# Altium project Register.PrjPcb
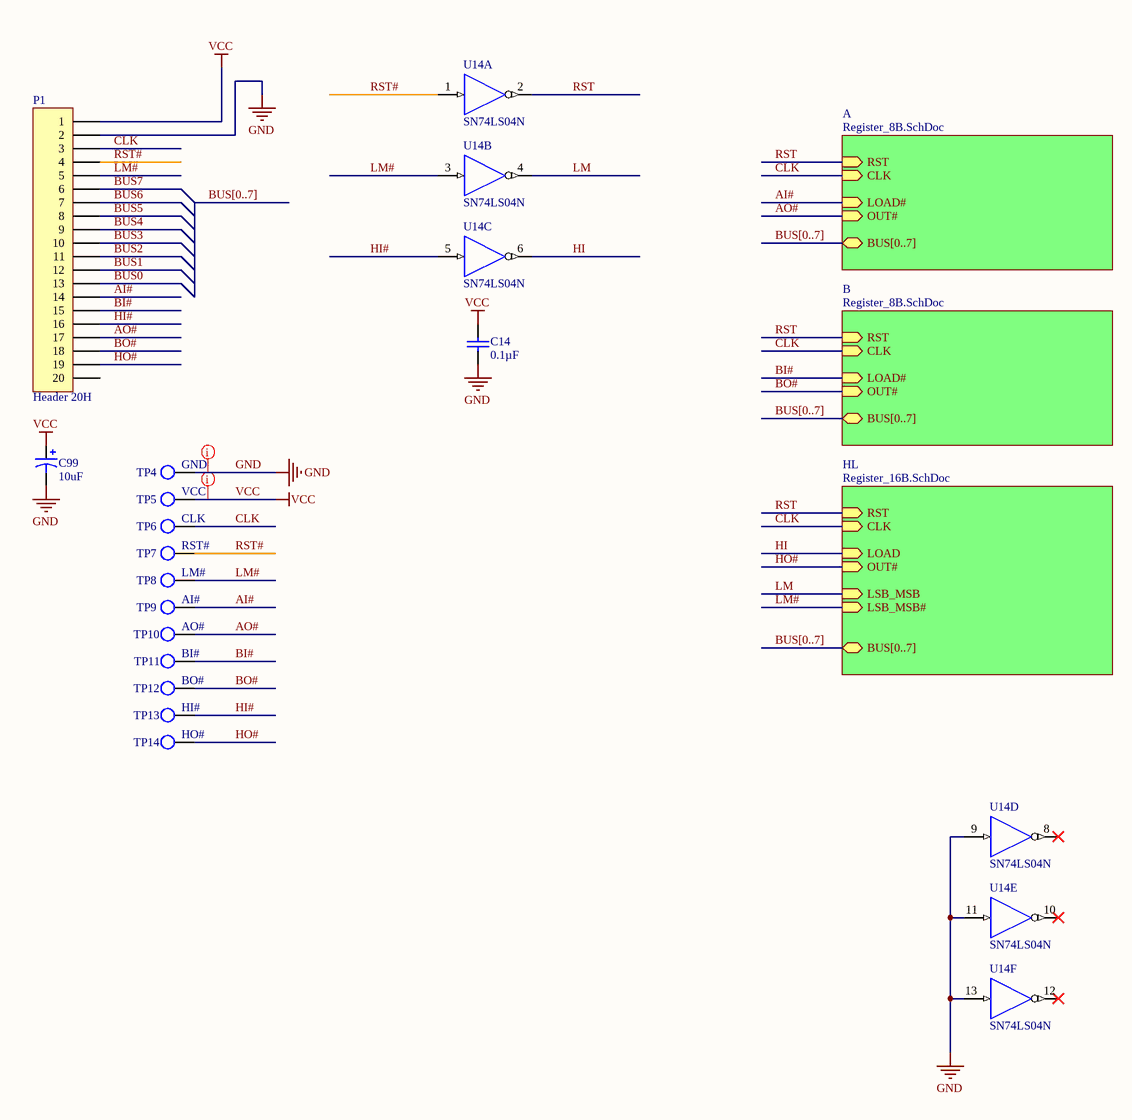
[diagram p0: Top.SchDoc]
1 sheet, 15 parts. Net scope: hierarchical (ports join the sheet entries above them; power ports are global).
Board file: Register.PcbDoc

## Sheet Top.SchDoc
size B; Author: E. Sims; Organization: Let's Build Rockets Inc.; SheetNumber: 1; SheetTotal: 3

### Parts
C14  Capacitance: 0.1µF  [VISH-K104K15X7RF5TL2]  (hidden comment: K104K15X7RF5TL2)
C99  value 10uF  [C5x7]  (hidden comment: Cap Pol5)
P1  Header 20H  [HDR1X20H]
TP4  GND  [KSTN-5011_V]  (no BOM)
TP5  VCC  [KSTN-5011_V]  (no BOM)
TP6  CLK  [KSTN-5011_V]  (no BOM)
TP7  RST#  [KSTN-5011_V]  (no BOM)
TP8  LM#  [KSTN-5011_V]  (no BOM)
TP9  AI#  [KSTN-5011_V]  (no BOM)
TP10  AO#  [KSTN-5011_V]  (no BOM)
TP11  BI#  [KSTN-5011_V]  (no BOM)
TP12  BO#  [KSTN-5011_V]  (no BOM)
TP13  HI#  [KSTN-5011_V]  (no BOM)
TP14  HO#  [KSTN-5011_V]  (no BOM)
U14  SN74LS04N  [N014]  (parts A,B,C,D,E,F of 6)

### Sub-sheets
A = Register_8B.SchDoc (file not in this document): RST (in), BUS[0..7] (bidir), CLK (in), OUT# (in), LOAD# (in)
B = Register_8B.SchDoc (file not in this document): RST (in), BUS[0..7] (bidir), CLK (in), OUT# (in), LOAD# (in)
HL = Register_16B.SchDoc (file not in this document): RST (in), BUS[0..7] (bidir), CLK (in), OUT# (in), LOAD (in), LSB_MSB# (in), LSB_MSB (in)

### Nets
GND: C14.2 C99.2 P1.2 TP4.1 U14.7(GND) U14.9(A) U14.11(A) U14.13(A)
VCC: C14.1 C99.1 P1.1 TP5.1 U14.14(VCC)
AI#: P1.14 TP9.1 ; sheet A/LOAD#
AO#: P1.17 TP10.1 ; sheet A/OUT#
BI#: P1.15 TP11.1 ; sheet B/LOAD#
BO#: P1.18 TP12.1 ; sheet B/OUT#
BUS0: P1.13
BUS1: P1.12
BUS2: P1.11
BUS3: P1.10
BUS4: P1.9
BUS5: P1.8
BUS6: P1.7
BUS7: P1.6
CLK: P1.3 TP6.1 ; sheet A/CLK, sheet B/CLK, sheet HL/CLK
HI: U14.6(Y) ; sheet HL/LOAD
HI#: P1.16 TP13.1 U14.5(A)
HO#: P1.19 TP14.1 ; sheet HL/OUT#
LM: U14.4(Y) ; sheet HL/LSB_MSB
LM#: P1.5 TP8.1 U14.3(A) ; sheet HL/LSB_MSB#
RST: U14.2(Y) ; sheet A/RST, sheet B/RST, sheet HL/RST
RST#: P1.4 TP7.1 U14.1(A)

Not connected (* = marked no-connect by the designer): P1 20; U14 8(Y)* 10(Y)* 12(Y)*

### Buses and harness runs
bus BUS[0..7]
bus BUS[0..7] = sheet A/BUS[0..7]
bus BUS[0..7] = sheet B/BUS[0..7]
bus BUS[0..7] = sheet HL/BUS[0..7]

### Layout directives
rule Width Constraint [Pref Width = 20mil    Min Width = 20mil    Max Width = 50mil]; rule Routing Via Style [Pref Size = 35mil    Pref Hole Size = 20mil]; net class PWR: GND, VCC

### Notes on the sheet
- Let's Build Rocket's Inc. Modular Paylaod System Based on TMP-010 Rev
  For more information visit https://github.com/LetsBuildRockets/Modular-Payload-System
  This work is licensed under CC BY-NC 4.0. To view a copy of this license, visit https://creativecommons.org/licenses/by-nc/4.0
- Title
- Size:
- Date:
- Assembly Variant:
- B
- Number:
- Time:
- Revision:
- Sheet
- of
- Author:
- File:

### Library data of the parts
C14 = CMP-2000-06508-1: Ceramic Capacitor, 100 nF, +/- 10%, 50 V, -55 to 125 degC, 2-Pin THD, RoHS, Tape and Reel; Manufacturer: Vishay; Other Names: BC1084CT; Catalog Drawings: Mono-KapSide2-15_5.58Mono-KapSide1_15; Temperature Coefficient: X7R; Voltage - Rated: 50V; Online Catalog: Mono-Kap™Series; Size / Dimension: 0.157"Lx0.098"W(4.00mmx2.50mm); Operating Temperature: -55°C~125°C; Family: CeramicCapacitors; Manufacturer URL: http://www.vishay.com/; Standard Package: 1; Thickness (Max): -; Ratings: -; Datasheet Version: 08/2013; Package Description: 2-Pin Through Hole Device, Body 4 x 2.6 mm; Mounting Type: ThroughHole; Features: -; Lead Spacing: 0.098"(2.50mm); Tolerance: ±10%; Category: Capacitors; Mounting Technology: ThroughHole; Lead Style: Straight; Datasheet URL: http://www.vishay.com/docs/45171/kseries.pdf; Applications: GeneralPurpose; Package / Case: Radial; Height - Seated (Max): 0.220"(5.58mm); Package Reference: K104K15X7RF5TL2; Series: Mono-Kap™K; Packaging: CutTape(CT)
C99 = Cap Pol5: Polarized Capacitor; Published: 8-Jun-2000; LatestRevisionDate: 17-Jul-2002; LatestRevisionNote: Re-released for DXP Platform.; PackageReference: POLAR0.8; Publisher: Altium Limited; PackageDescription: Polarized Capacitor; 2 Leads
P1 = Header 20H: Header, 20-Pin, Right Angle; System: Connector; LatestRevisionDate: 17-Jul-2002; LatestRevisionNote: Re-released for DXP Platform.; Publisher: Altium Limited
TP4-TP14 = TP
U14 = SN74LS04N: Hex Inverter; Published: 8-Jun-2000; LatestRevisionDate: 04-Mar-2005; LatestRevisionNote: Stylized 3D Model Added.; DatasheetVersion: Mar-1988; PackageVersion: Oct-1995; PackageReference: N014; Publisher: Altium Limited; PackageDescription: DIP; 14 Leads; Row Spacing 7.62 mm; Pitch 2.54 mm; ComponentLink1Description: Manufacturer Link; ComponentLink1URL: http://www.ti.com/; ComponentLink2Description: Datasheet; ComponentLink2URL: http://www-s.ti.com/sc/ds/sn74ls04.pdf